# Altium schematic sheet [1]-power sypply.SchDoc
size A3; SheetNumber: 1; SheetTotal: 3
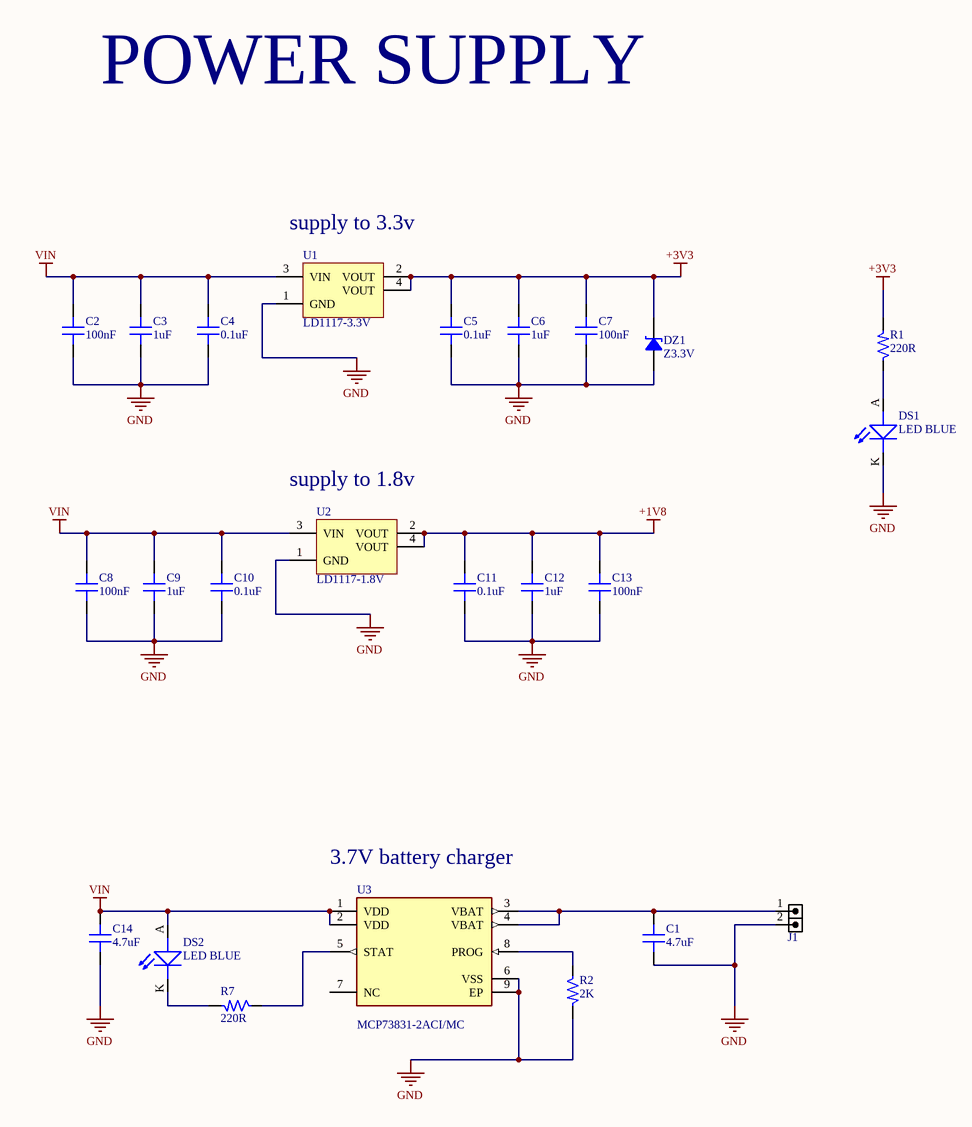
[diagram p0: [1]-power sypply.SchDoc]

## Parts
C1  4.7uF  [CAP 0603_1608]
C2  100nF  [CAP 0603_1608]
C3  1uF  [CAP 0603_1608]
C4  0.1uF  [CAP 0603_1608]
C5  0.1uF  [CAP 0603_1608]
C6  1uF  [CAP 0603_1608]
C7  100nF  [CAP 0603_1608]
C8  100nF  [CAP 0603_1608]
C9  1uF  [CAP 0603_1608]
C10  0.1uF  [CAP 0603_1608]
C11  0.1uF  [CAP 0603_1608]
C12  1uF  [CAP 0603_1608]
C13  100nF  [CAP 0603_1608]
C14  4.7uF  [CAP 0603_1608]
DS1  LED BLUE  [LED_0805]
DS2  LED BLUE  [LED_0805]
DZ1  Z3.3V  [SOD-323]
J1  HDR2  [HDR1SE_M_1X2]  (value not drawn)
R1  220R  [RES_0805]
R2  2K  [RES_0805]
R7  220R  [RES_0805]
U1  LD1117-3.3V  [SOT-223-4 6.5X7MM P2.3MM]
U2  LD1117-1.8V  [SOT-223-4 6.5X7MM P2.3MM]
U3  MCP73831-2ACI/MC  [FP-C04-123-MFG]

## Nets
+1V8: C11.2 C12.2 C13.2 U2.2(VOUT) U2.4(VOUT)
+3V3: C5.2 C6.2 C7.2 DZ1.2 R1.2 U1.2(VOUT) U1.4(VOUT)
GND: C1.1 C2.1 C3.1 C4.1 C5.1 C6.1 C7.1 C8.1 C9.1 C10.1 C11.1 C12.1 C13.1 C14.1 DS1.K(CATHODE) DZ1.1 J1.2 R2.2 U1.1(GND) U2.1(GND) U3.6(VSS) U3.9(EP)
VIN: C2.2 C3.2 C4.2 C8.2 C9.2 C10.2 C14.2 DS2.A(ANODE) U1.3(VIN) U2.3(VIN) U3.1(VDD) U3.2(VDD)
NetC1_2: C1.2 J1.1 U3.3(VBAT) U3.4(VBAT)
NetDS1_A: DS1.A(ANODE) R1.1
NetDS2_K: DS2.K(CATHODE) R7.2
NetR2_1: R2.1 U3.8(PROG)
NetR7_1: R7.1 U3.5(STAT)

Not connected (* = marked no-connect by the designer): U3 7(NC)

## Notes on the sheet
- POWER SUPPLY
- (near U1) supply to 3.3v
- (near U2) supply to 1.8v
- (near U3) 3.7V battery charger

## Library data of the parts
C1 C3-C6 C9-C12 C14 = Cap 0603: SMT Capacitor; VALUE: 100nF
C2 C7 C8 C13 = Cap 0603: SMT Capacitor; VALUE: 100nF
DS1 DS2 = LED_BLUE-3V3-20mA-0805: Blue 470nm LED Indication - Discrete 3.3V 0805 (2012 Metric); Manufacturer: Vishay Lite-On; Manufacturer Part Number: LTST-C171TBKT; Alternate Part Number-1: NA; Case/Package: 0805; Supplier-1: SP ROAD; Supplier Part Number-1: LTST-C171TBKT
DZ1 = Zener 200mW 3.3V (SMD SOD-323): Zener Diode; PartNumber: BZX384B3V3-G
J1 = HDRTST_1X2: HEADER, 1mm pitch, test, SMD; VALUE: HDR2
R1 R2 R7 = RES_220R-0.125W-1%-0805: 220 Ohms ±1% 0.125W, 1/8W Chip Resistor 0805 (2012 Metric) Automotive AEC-Q200 Thick Film; Manufacturer: Walsin; Manufacturer Part Number: WR08X2200FTL; Alternate Part Number-1: RS-05K2200FT; Case/Package: 0805; Supplier-1: SIRICOM; Supplier Part Number-1: WR08X2200FTL
U1 = LD1117-3.3V (SMD SOT-223): Linear Voltage Regulator IC  1 Output  800mA SOT-223; PartNumber: LD1117S33CTR
U2 = LD1117-1.8V (SMD SOT-223): Linear Voltage Regulator IC  1 Output  800mA SOT-223; PartNumber: LD1117S18CTR
U3 = CMP-06318-000002-1: IC CONTROLLER LI-ION 4.2V 8DFN; Manufacturer: Microchip; Number Of Cells: 1; Min Supply Voltage: 3.75V; Standoff Height: 0mm; Nominal Supply Current: 0.1-510uA; Max Junction Temp: +125°C; Max Supply Voltage: 6V; Temperature Range High: +85°C; Mouser Description: Battery Management Li-Ion/Li-Poly Charg Mgnt 4.2V Vreg out; Device Class L2: Power Management ICs; ComponentLink2Description: Datasheet; Footprint Url: http://ww1.microchip.com/downloads/en/DeviceDoc/8L_DFN_2x3x0_9_MC_C04-123C.pdf; Output Voltage: 4.2V; ComponentLink2URL: http://ww1.microchip.com/downloads/en/DeviceDoc/20001984g.pdf; Package: C04-123; Ipc Land Pattern Name: DFN200X300X90-8; Number Of Outputs: 1; Manufacturer Part Number: MCP73831-2ACI/MC; Device Class L3: Battery Management; Device Class L1: Integrated Circuits (ICs); Digikey Description: IC CONTROLLER LI-ION 4.2V 8DFN; Category: IC; Temperature Range Low: -40°C; Automotive: No; Temperature: -40°C to +85°C; Octopart: https://octopart.com/mcp73831-2aci%2Fmc-microchip-16517355; RoHS: TRUE; Ambient Temperature Range Low: -40°C; Height: 1mm; Lead Free: Yes; Ambient Temperature Range High: +85°C